# EAGLE schematic freeduino_V1.19.2-THbig (EAGLE 5.10)
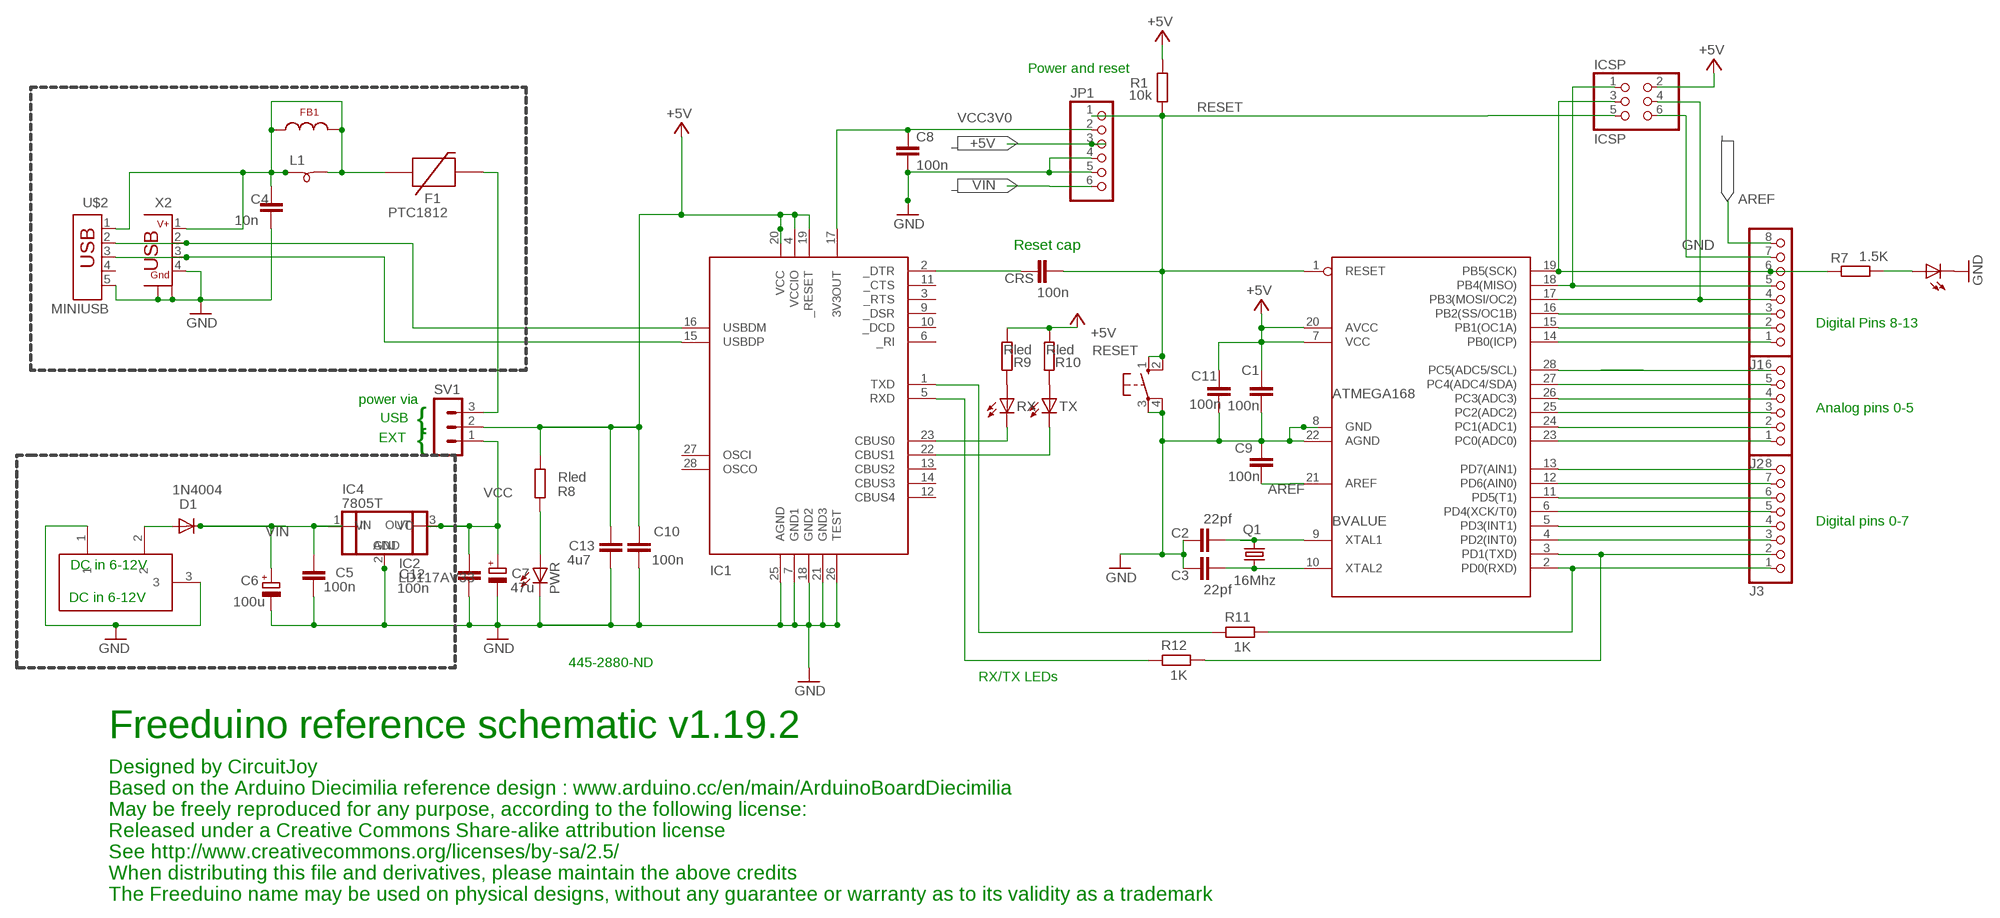
[diagram p0: schematic, sheet 1]

## Parts
BVALUE  ATMEGA168  MEGA8-P  [DIL28-3]
C1  100n  C-EU050-025X075  [C050-025X075]
C2  22pf  C-EU025-024X044  [C025-024X044]
C3  22pf  C-EU025-024X044  [C025-024X044]
C4  10n  C-EU050-025X075  [C050-025X075]
C5  100n  C-EU050-025X075  [C050-025X075]
C6  100u  CPOL-EUE5-10.5  [E5-10,5]
C7  47u  CPOL-EUE3.5-8  [E3,5-8]
C8  100n  C-EU050-025X075  [C050-025X075]
C9  100n  C-EU050-025X075  [C050-025X075]
C10  100n  C-EU050-025X075  [C050-025X075]
C11  100n  C-EUC1206  [C1206]
C12  100n  C-EU050-025X075  [C050-025X075]
C13  4u7  C-EU050-025X075  [C050-025X075]
CRS  100n  C-EU050-025X075  [C050-025X075]
D1  1N4004  DIODEPTH  [DIODE-0.4]
F1  PTC1812  [C1812]
FB1  FB  [FB3.8]
IC1  FT232RL  FT232RL-PINNED  [SSOP28DB]
IC2  LD117AV33  [TO220L1]
IC4  7805T  [TO220H]
ICSP  ICSP  PINHD-2X3  [2X03]
J1  PINHD-1X8  [1X08]
J2  PINHD-1X6  [1X06]
J3  PINHD-1X8  [1X08]
JP1  PINHD-1X6  [1X06]
L1  SM-B5  [SM-B5]
P13  LED3MM  [LED3MM]
PWR  LED3MM  [LED3MM]
Q1  16Mhz  CRYSTALHC49U-V  [HC49U-V]
R1  10k  R-EU_0207/7  [0207/7]
R7  1.5K  R-EU_0207/7  [0207/7]
R8  Rled  R-EU_0207/7  [0207/7]
R9  Rled  R-EU_0207/7  [0207/7]
R10  Rled  R-EU_0207/7  [0207/7]
R11  1K  R-EU_0207/7  [0207/7]
R12  1K  R-EU_0207/7  [0207/7]
RESET  10-XX  [B3F-10XX]
RX  LED3MM  [LED3MM]
SV1  MA03-1  [MA03-1]
TX  LED3MM  [LED3MM]
U$1  DC-IN  POWERSUPPLY_DC21MM4UCON  [4UCON-POWER-JACK]
U$2  MINIUSB  [UX60A-MB-5SY]
X2  CON-USB-B  [USB-WSHIELDPADS]

## Nets
+5V [power]: BVALUE.7(VCC) BVALUE.20(AVCC) C1.1 C10.2 C11.2 C13.2 IC1.4(VCCIO) IC1.19(_RESET) IC1.20(VCC) ICSP.2 JP1.3 R1.2 R8.1 R9.1 R10.1 SV1.2
AREF: BVALUE.21(AREF) C9.1 J1.8
GND [power]: BVALUE.8(GND) BVALUE.22(AGND) C1.2 C2.1 C3.1 C4.1 C5.1 C6.- C7.- C8.2 C9.2 C10.1 C11.1 C12.1 C13.1 IC1.7(GND1) IC1.18(GND2) IC1.21(GND3) IC1.25(AGND) IC1.26(TEST) IC2.1(ADJ) IC4.2(GND) ICSP.6 J1.7 JP1.4 JP1.5 P13.K(C) PWR.K(C) RESET.3(P) RESET.4(P1) U$1.1 U$1.3 U$2.5 X2.4 X2.SH1(GND) X2.SH2(GND)
M8RXD [finepitch]: IC1.1(TXD) R11.1
M8TXD [finepitch]: IC1.5(RXD) R12.1
N$2: BVALUE.15(PB1(OC1A)) J1.2
N$3: PWR.A R8.2
N$5 [finepitch]: IC1.23(CBUS0) RX.K(C)
N$6: BVALUE.9(XTAL1) C2.2 Q1.2
N$7 [power]: F1.2 SV1.3
N$8 [power]: D1.A U$1.2
N$9 [finepitch]: IC1.16(USBDM) U$2.2 X2.2
N$10: BVALUE.4(PD2(INT0)) J3.3
N$11: BVALUE.5(PD3(INT1)) J3.4
N$12: BVALUE.6(PD4(XCK/T0)) J3.5
N$13: BVALUE.11(PD5(T1)) J3.6
N$14: BVALUE.12(PD6(AIN0)) J3.7
N$15: BVALUE.13(PD7(AIN1)) J3.8
N$16: BVALUE.23(PC0(ADC0)) J2.1
N$17: BVALUE.24(PC1(ADC1)) J2.2
N$18: BVALUE.25(PC2(ADC2)) J2.3
N$19: BVALUE.26(PC3(ADC3)) J2.4
N$20: BVALUE.27(PC4(ADC4/SDA)) J2.5
N$21: BVALUE.28(PC5(ADC5/SCL)) J2.6
N$22: BVALUE.3(PD1(TXD)) J3.2 R12.2
N$23: BVALUE.16(PB2(SS/OC1B)) J1.3
N$24 [finepitch]: IC1.15(USBDP) U$2.3 X2.3
N$26: BVALUE.18(PB4(MISO)) ICSP.1 J1.5
N$28: BVALUE.14(PB0(ICP)) J1.1
N$29 [finepitch]: IC1.22(CBUS1) TX.K(C)
N$31: BVALUE.10(XTAL2) C3.2 Q1.1
N$32: P13.A R7.1
N$34: R10.2 TX.A
N$35 [power]: C4.2 F1.1 FB1.P$1 FB1.P$2 L1.1 L1.2 U$2.1 X2.1
N$36: R9.2 RX.A
N$37 [finepitch]: CRS.1 IC1.2(_DTR)
N$43: BVALUE.17(PB3(MOSI/OC2)) ICSP.4 J1.4
N$44: BVALUE.2(PD0(RXD)) J3.1 R11.2
RESET: BVALUE.1(RESET) CRS.2 ICSP.5 JP1.1 R1.1 RESET.1(S) RESET.2(S1)
SCK: BVALUE.19(PB5(SCK)) ICSP.3 J1.6 R7.2
VCC [power]: C7.+ C12.2 IC2.2(OUT) IC4.3(VO) SV1.1
VCC3V0 [power]: C8.1 IC1.17(3V3OUT) JP1.2
VIN [power]: C5.2 C6.+ D1.C IC2.3(IN) IC4.1(VI) JP1.6
Unconnected: IC1.3(_RTS) IC1.6(_RI) IC1.9(_DSR) IC1.10(_DCD) IC1.11(_CTS) IC1.12(CBUS4) IC1.13(CBUS2) IC1.14(CBUS3) IC1.27(OSCI) IC1.28(OSCO) U$2.4

## Notes on the sheet
- Power and reset
- Reset cap
- Digital Pins 8-13
- power via
- Analog pins 0-5
- USB
- {
- EXT
- {
- Digital pins 0-7
- DC in 6-12V
- DC in 6-12V
- 445-2880-ND
- RX/TX LEDs
- Freeduino reference schematic v1.19.2
- Designed by CircuitJoy
- Based on the Arduino Diecimilia reference design : www.arduino.cc/en/main/ArduinoBoardDiecimilia
- May be freely reproduced for any purpose, according to the following license:
- Released under a Creative Commons Share-alike attribution license
- See http://www.creativecommons.org/licenses/by-sa/2.5/
- When distributing this file and derivatives, please maintain the above credits
- The Freeduino name may be used on physical designs, without any guarantee or warranty as to its validity as a trademark

## Library data of the parts
BVALUE = my-library:MEGA8-P: MICROCONTROLLER 8 Kbytes FLASH 1 kbytes SRAM 512 bytes EEPROM USART 4-channel 10 bit ADC 2-channel 8 bit ADC Source: avr.lbr
C1-C5 C8-C13 CRS = rcl:C-EU: CAPACITOR, European symbol
C6 C7 = rcl:CPOL-EU: POLARIZED CAPACITOR, European symbol
D1 = SparkFunEagle-6-6-07:DIODE: Diode These are standard reverse protection diodes and small signal diodes. SMA package can handle up to about 1A. SOD-323 can handle about 200mA. What the SOD-323 package when ordering, there are some mfgs out there that are 5-pin packages.
F1 = SparkFunEagle-6-6-07:PTC: Resettable Fuse PTC Resettable Fuse. Spark Fun Electronics SKU : COM-08357
FB1 = mylib4:FB: Ferrite bead filter
IC1 = my-library:FT232RL-PINNED: USB UART FT232RL 4th Generation USB UART (USB <-> Serial) Controller. Spark Fun Electronics SKU : COM-00650
IC2 = v-reg:LD117A?*: Low drop fixed and adjustable positive voltage regulators 1 A Source: http://www.st.com/stonline/products/literature/ds/7194/ld1117axx.pdf
IC4 = SparkFunEagle-6-6-07:78*: Positive VOLTAGE REGULATOR Source: http://cache.national.com/ds/LM/LM78L05.pdf http://www.fairchildsemi.com/ds/LM/LM7805.pdf
ICSP = pinhead:PINHD-2X3: PIN HEADER
J1 J3 = pinhead:PINHD-1X8: PIN HEADER
J2 JP1 = pinhead:PINHD-1X6: PIN HEADER
L1 = inductor-neosid:SM-B: INDUCTOR SMD Bead inductor
P13 PWR RX TX = my-led:LED: LED OSRAM: - CHIPLED LG R971, LG N971, LY N971, LG Q971, LY Q971, LO R971, LY R971 LH N974, LH R974 LS Q976, LO Q976, LY Q976 LO Q996 - Hyper CHIPLED LW Q18S LB Q993, LB Q99A, LB R99A - SideLED LS A670, LO A670, LY A670, LG A670, LP A670 LB A673, LV A673, LT A673, LW A673 LH A674 LY A675 LS A676, LA A676, LO A676, LY A676, LW A676 LS A679, LY A679, LG A679 - Hyper Micro SIDELED® LS Y876, LA Y876, LO Y876, LY Y876 LT Y87S - SmartLED LW L88C, LW L88S LB L89C, LB L89S, LG L890 LS L89K, LO L89K, LY L89K LS L896, LA L896, LO L896, LY L896 - TOPLED LS T670, LO T670, LY T670, LG T670, LP T670 LSG T670, LSP T670, LSY T670, LOP T670, LYG T670 LG T671, LOG T671, LSG T671 LB T673, LV T673, LT T673, LW T673 LH T674 LS T676, LA T676, LO T676, LY T676, LB T676, LH T676, LSB T676, LW T676 LB T67C, LV T67C, LT T67C, LS T67K, LO T67K, LY T67K, LW E67C LS E67B, LA E67B, LO E67B, LY E67B, LB E67C, LV E67C, LT E67C LW T67C LS T679, LY T679, LG T679 LS T770, LO T770, LY T770, LG T770, LP T770 LB T773, LV T773, LT T773, LW T773 LH T774 LS E675, LA E675, LY E675, LS T675 LS T776, LA T776, LO T776, LY T776, LB T776 LHGB T686 LT T68C, LB T68C - Hyper Mini TOPLED® LB M676 - Mini TOPLED Santana® LG M470 LS M47K, LO M47K, LY M47K Source: http://www.osram.convergy.de/
Q1 = crystal:CRYSTAL: CRYSTAL
R1 R7-R12 = rcl:R-EU_: RESISTOR, European symbol
RESET = switch-omron:10-XX: OMRON SWITCH
SV1 = con-lstb:MA03-1: PIN HEADER
U$1 = mylib4:POWERSUPPLY_DC21MM
U$2 = mini-usb:MINIUSB
X2 = mylib4:CON-USB-B: BERG USB connector

## Net classes
0 default: width 0.203 mm, clearance 0.203 mm
1 power: width 0.3 mm, clearance 0.254 mm
2 finepitch: width 0.203 mm, clearance 0.203 mm